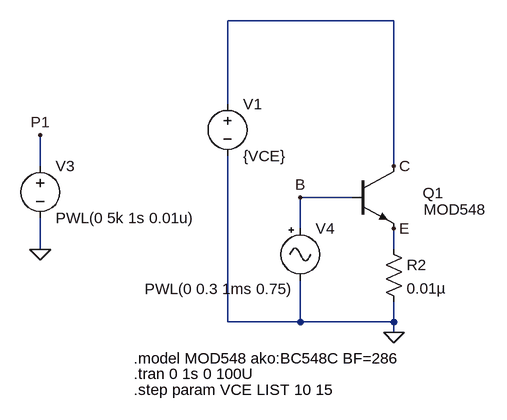
[diagram p0: schematic CircuitoSegundaParte.asc]
CircuitoSegundaParte.asc, the LTspice schematic file:
Version 4
SHEET 1 880 712
WIRE 256 -48 0 -48
WIRE 0 80 0 -48
WIRE -288 176 -288 128
WIRE 256 176 256 -48
WIRE 192 224 112 224
WIRE 112 272 112 224
WIRE -288 304 -288 256
WIRE 256 304 256 272
WIRE 0 416 0 160
WIRE 112 416 112 352
WIRE 112 416 0 416
WIRE 256 416 256 384
WIRE 256 416 112 416
WIRE 256 432 256 416
FLAG 256 176 C
FLAG 112 224 B
FLAG 256 432 0
FLAG -288 128 P1
FLAG -288 304 0
FLAG 256 272 E
SYMBOL npn 192 176 R0
WINDOW 0 108 41 Left 2
WINDOW 3 110 67 Left 2
SYMATTR InstName Q1
SYMATTR Value MOD548
SYMBOL voltage 0 64 R0
WINDOW 123 0 0 Left 0
WINDOW 39 0 0 Left 0
SYMATTR InstName V1
SYMATTR Value {VCE}
SYMBOL voltage -288 160 R0
WINDOW 123 0 0 Left 0
WINDOW 39 0 0 Left 0
SYMATTR InstName V3
SYMATTR Value PWL(0 5k 1s 0.01u)
SYMBOL Misc\\signal 112 256 R0
WINDOW 3 -239 109 Left 2
WINDOW 123 0 0 Left 0
WINDOW 39 0 0 Left 0
SYMATTR Value PWL(0 0.3 1ms 0.75)
SYMATTR InstName V4
SYMBOL res 240 288 R0
SYMATTR InstName R2
SYMATTR Value 0.01µ
TEXT -144 472 Left 2 !.model MOD548 ako:BC548C BF=286
TEXT -144 496 Left 2 !.tran 0 1s 0 100U
TEXT -144 520 Left 2 !.step param VCE LIST 10 15

The netlist it stands for:
* CircuitoSegundaParte.asc
Q1 C B E 0 MOD548
V1 C 0 {VCE}
V3 P1 0 PWL(0 5k 1s 0.01u)
V4 B 0 PWL(0 0.3 1ms 0.75)
R2 E 0 0.01µ
.model NPN NPN
.model PNP PNP
.lib standard.bjt
.model MOD548 ako:BC548C BF=286
.tran 0 1s 0 100U
.step param VCE LIST 10 15
.backanno
.end